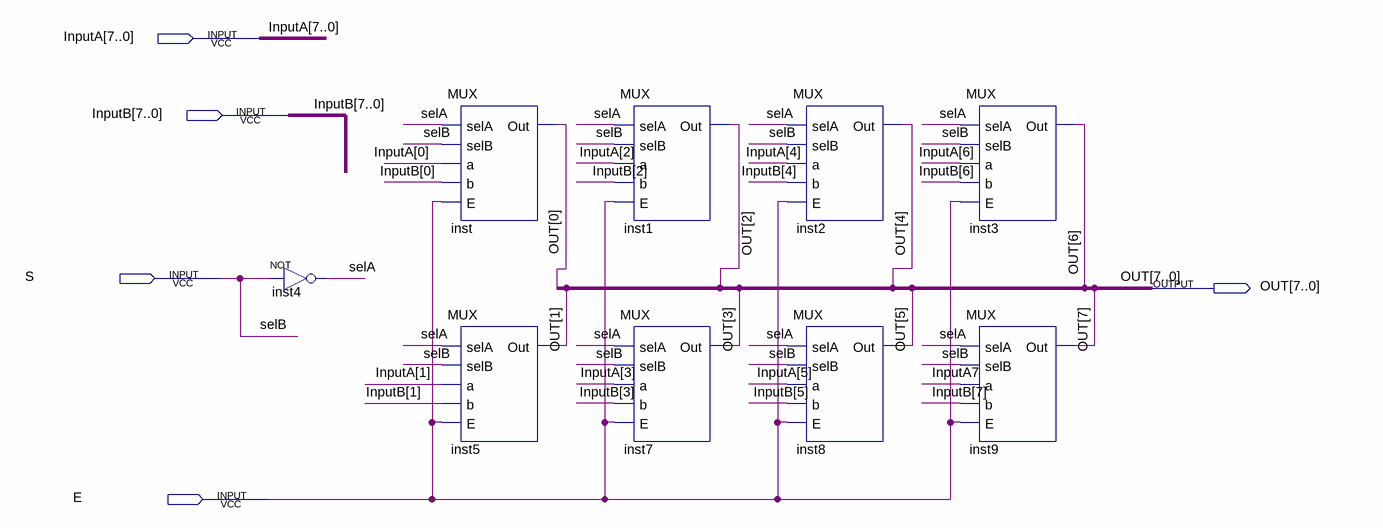
[diagram p0: schematic sheet]
// Quartus schematic Lab1_1.bdf as structural Verilog: 9 symbols, 5 pins
module Lab1_1 (
  input  [7:0] InputA,
  input  [7:0] InputB,
  input  S,
  input  E,
  output [7:0] OUT
);

  wire selA;

  not inst4 (selA, S);
  MUX inst (.selA(selA), .selB(S), .a(InputA[0]), .b(InputB[0]), .E(E), .Out(OUT[0]));
  MUX inst5 (.selA(selA), .selB(S), .a(InputA[1]), .b(InputB[1]), .E(E), .Out(OUT[1]));
  MUX inst1 (.selA(selA), .selB(S), .a(InputA[2]), .b(InputB[2]), .E(E), .Out(OUT[2]));
  MUX inst7 (.selA(selA), .selB(S), .a(InputA[3]), .b(InputB[3]), .E(E), .Out(OUT[3]));
  MUX inst2 (.selA(selA), .selB(S), .a(InputA[4]), .b(InputB[4]), .E(E), .Out(OUT[4]));
  MUX inst8 (.selA(selA), .selB(S), .a(InputA[5]), .b(InputB[5]), .E(E), .Out(OUT[5]));
  MUX inst3 (.selA(selA), .selB(S), .a(InputA[6]), .b(InputB[6]), .E(E), .Out(OUT[6]));
  MUX inst9 (.selA(selA), .selB(S), .a(InputA[7]), .b(InputB[7]), .E(E), .Out(OUT[7]));

  // Other names for the same wires on the sheet: selB = S
endmodule
